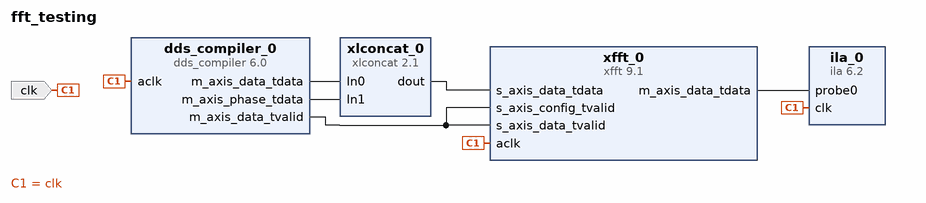
[diagram p0: block diagram of the top level]
# Vivado block design fft_testing, xc7z020clg400-3, Vivado 2019.1
create_bd_design fft_testing

create_bd_port -dir I -type clk clk
set_property -dict {CONFIG.FREQ_HZ 100000000} [get_bd_ports clk]

create_bd_cell -type ip -vlnv xilinx.com:ip:dds_compiler:6.0 dds_compiler_0
set_property -dict [list \
  CONFIG.Has_Phase_Out true \
  CONFIG.Latency 7 \
  CONFIG.M_DATA_Has_TUSER Not_Required \
  CONFIG.Noise_Shaping None \
  CONFIG.Output_Frequency1 0 \
  CONFIG.Output_Selection Sine \
  CONFIG.Output_Width 16 \
  CONFIG.PINC1 0000000000001010 \
  CONFIG.Parameter_Entry Hardware_Parameters \
  CONFIG.Phase_Width 16 \
] [get_bd_cells dds_compiler_0]
create_bd_cell -type ip -vlnv xilinx.com:ip:xfft:9.1 xfft_0
set_property -dict [list \
  CONFIG.input_width 16 \
  CONFIG.number_of_stages_using_block_ram_for_data_and_phase_factors 3 \
  CONFIG.scaling_options unscaled \
  CONFIG.target_clock_frequency 100 \
  CONFIG.target_data_throughput 100 \
] [get_bd_cells xfft_0]
create_bd_cell -type ip -vlnv xilinx.com:ip:ila:6.2 ila_0
set_property -dict [list \
  CONFIG.C_DATA_DEPTH 16384 \
  CONFIG.C_ENABLE_ILA_AXI_MON false \
  CONFIG.C_MONITOR_TYPE Native \
  CONFIG.C_NUM_OF_PROBES 1 \
  CONFIG.C_PROBE0_WIDTH 64 \
] [get_bd_cells ila_0]
create_bd_cell -type ip -vlnv xilinx.com:ip:xlconcat:2.1 xlconcat_0
set_property -dict {CONFIG.IN0_WIDTH 16 CONFIG.IN1_WIDTH 16} [get_bd_cells xlconcat_0]

# ---- connections ----

connect_bd_net [get_bd_ports clk] [get_bd_pins dds_compiler_0/aclk] [get_bd_pins ila_0/clk] [get_bd_pins xfft_0/aclk]
connect_bd_net [get_bd_pins xfft_0/m_axis_data_tdata] [get_bd_pins ila_0/probe0]
connect_bd_net [get_bd_pins dds_compiler_0/m_axis_data_tdata] [get_bd_pins xlconcat_0/In0]
connect_bd_net [get_bd_pins dds_compiler_0/m_axis_phase_tdata] [get_bd_pins xlconcat_0/In1]
connect_bd_net [get_bd_pins xlconcat_0/dout] [get_bd_pins xfft_0/s_axis_data_tdata]
connect_bd_net [get_bd_pins dds_compiler_0/m_axis_data_tvalid] [get_bd_pins xfft_0/s_axis_data_tvalid] [get_bd_pins xfft_0/s_axis_config_tvalid]

validate_bd_design
save_bd_design
